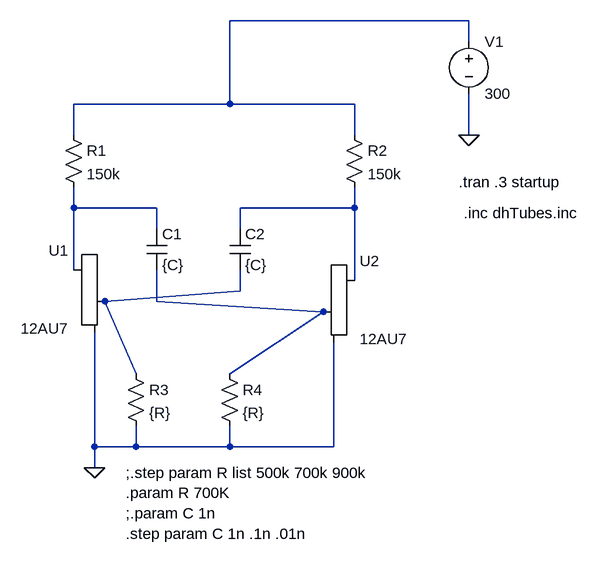
[diagram p0: schematic Astable-ECC82-1.asc]
Astable-ECC82-1.asc, the LTspice schematic file:
Version 4
SHEET 1 884 680
WIRE 704 -272 336 -272
WIRE 704 -240 704 -272
WIRE 336 -144 336 -272
WIRE 336 -144 96 -144
WIRE 528 -144 336 -144
WIRE 96 -96 96 -144
WIRE 528 -96 528 -144
WIRE 704 -96 704 -160
WIRE 96 16 96 -16
WIRE 224 16 96 16
WIRE 528 16 528 -16
WIRE 528 16 352 16
WIRE 224 48 224 16
WIRE 352 48 352 16
WIRE 96 112 96 16
WIRE 528 128 528 16
WIRE 352 144 352 112
WIRE 144 160 352 144
WIRE 224 160 224 112
WIRE 480 176 224 160
WIRE 192 272 144 160
WIRE 336 272 480 176
WIRE 128 384 128 208
WIRE 192 384 192 352
WIRE 192 384 128 384
WIRE 336 384 336 352
WIRE 336 384 192 384
WIRE 496 384 496 224
WIRE 496 384 336 384
WIRE 128 416 128 384
FLAG 128 416 0
FLAG 704 -96 0
SYMBOL Misc\\triode 96 160 M0
SYMATTR InstName U1
SYMATTR Value 12AU7
SYMATTR SpiceModel 12AU7
SYMBOL Misc\\triode 528 176 R0
SYMATTR InstName U2
SYMATTR Value 12AU7
SYMATTR SpiceModel 12AU7
SYMBOL voltage 704 -256 R0
WINDOW 123 0 0 Left 0
WINDOW 39 0 0 Left 0
SYMATTR InstName V1
SYMATTR Value 300
SYMBOL res 80 -112 R0
SYMATTR InstName R1
SYMATTR Value 150k
SYMBOL res 512 -112 R0
SYMATTR InstName R2
SYMATTR Value 150k
SYMBOL res 176 256 R0
SYMATTR InstName R3
SYMATTR Value {R}
SYMBOL res 320 256 R0
SYMATTR InstName R4
SYMATTR Value {R}
SYMBOL cap 208 48 R0
SYMATTR InstName C1
SYMATTR Value {C}
SYMBOL cap 336 48 R0
SYMATTR InstName C2
SYMATTR Value {C}
TEXT 696 24 Left 2 !.inc dhTubes.inc
TEXT 688 -24 Left 2 !.tran .3 startup
TEXT 176 424 Left 2 !;.step param R list 500k 700k 900k\n.param R 700K\n;.param C 1n\n.step param C 1n .1n .01n

The netlist it stands for:
* Astable-ECC82-1.asc
XU1 N002 N004 0 12AU7 12AU7
XU2 N003 N005 0 12AU7 12AU7
V1 N001 0 300
R1 N001 N002 150k
R2 N001 N003 150k
R3 N004 0 {R}
R4 N005 0 {R}
C1 N002 N005 {C}
C2 N003 N004 {C}
.inc dhTubes.inc
.tran .3 startup
;.step param R list 500k 700k 900k
.param R 700K
;.param C 1n
.step param C 1n .1n .01n
.backanno
.end